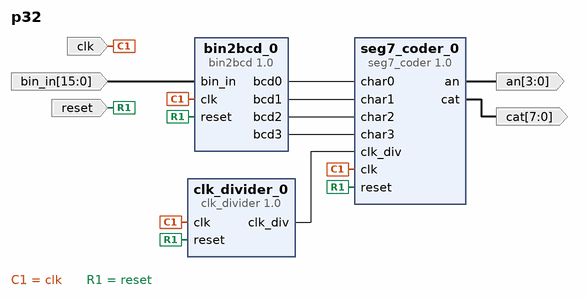
[diagram p0: block diagram of the top level]
# Vivado block design p32, xc7a35tcpg236-1, Vivado 2022.1
create_bd_design p32

create_bd_port -dir I -type clk clk
set_property -dict {CONFIG.FREQ_HZ 100000000} [get_bd_ports clk]
create_bd_port -dir I -from 15 -to 0 bin_in
create_bd_port -dir I -type rst reset
set_property -dict {CONFIG.POLARITY ACTIVE_HIGH} [get_bd_ports reset]
create_bd_port -dir O -from 7 -to 0 cat
create_bd_port -dir O -from 3 -to 0 an

create_bd_cell -type ip -vlnv xilinx.com:user:seg7_coder:1.0 seg7_coder_0
create_bd_cell -type ip -vlnv xilinx.com:user:bin2bcd:1.0 bin2bcd_0
create_bd_cell -type ip -vlnv xilinx.com:user:clk_divider:1.0 clk_divider_0

# ---- connections ----

connect_bd_net [get_bd_pins bin2bcd_0/bcd0] [get_bd_pins seg7_coder_0/char0]
connect_bd_net [get_bd_pins bin2bcd_0/bcd1] [get_bd_pins seg7_coder_0/char1]
connect_bd_net [get_bd_pins bin2bcd_0/bcd2] [get_bd_pins seg7_coder_0/char2]
connect_bd_net [get_bd_pins bin2bcd_0/bcd3] [get_bd_pins seg7_coder_0/char3]
connect_bd_net [get_bd_ports bin_in] [get_bd_pins bin2bcd_0/bin_in]
connect_bd_net [get_bd_ports clk] [get_bd_pins bin2bcd_0/clk] [get_bd_pins clk_divider_0/clk] [get_bd_pins seg7_coder_0/clk]
connect_bd_net [get_bd_pins clk_divider_0/clk_div] [get_bd_pins seg7_coder_0/clk_div]
connect_bd_net [get_bd_ports reset] [get_bd_pins bin2bcd_0/reset] [get_bd_pins clk_divider_0/reset] [get_bd_pins seg7_coder_0/reset]
connect_bd_net [get_bd_pins seg7_coder_0/an] [get_bd_ports an]
connect_bd_net [get_bd_pins seg7_coder_0/cat] [get_bd_ports cat]

validate_bd_design
save_bd_design
